# Altium project Driver_V1-1.PrjPcb
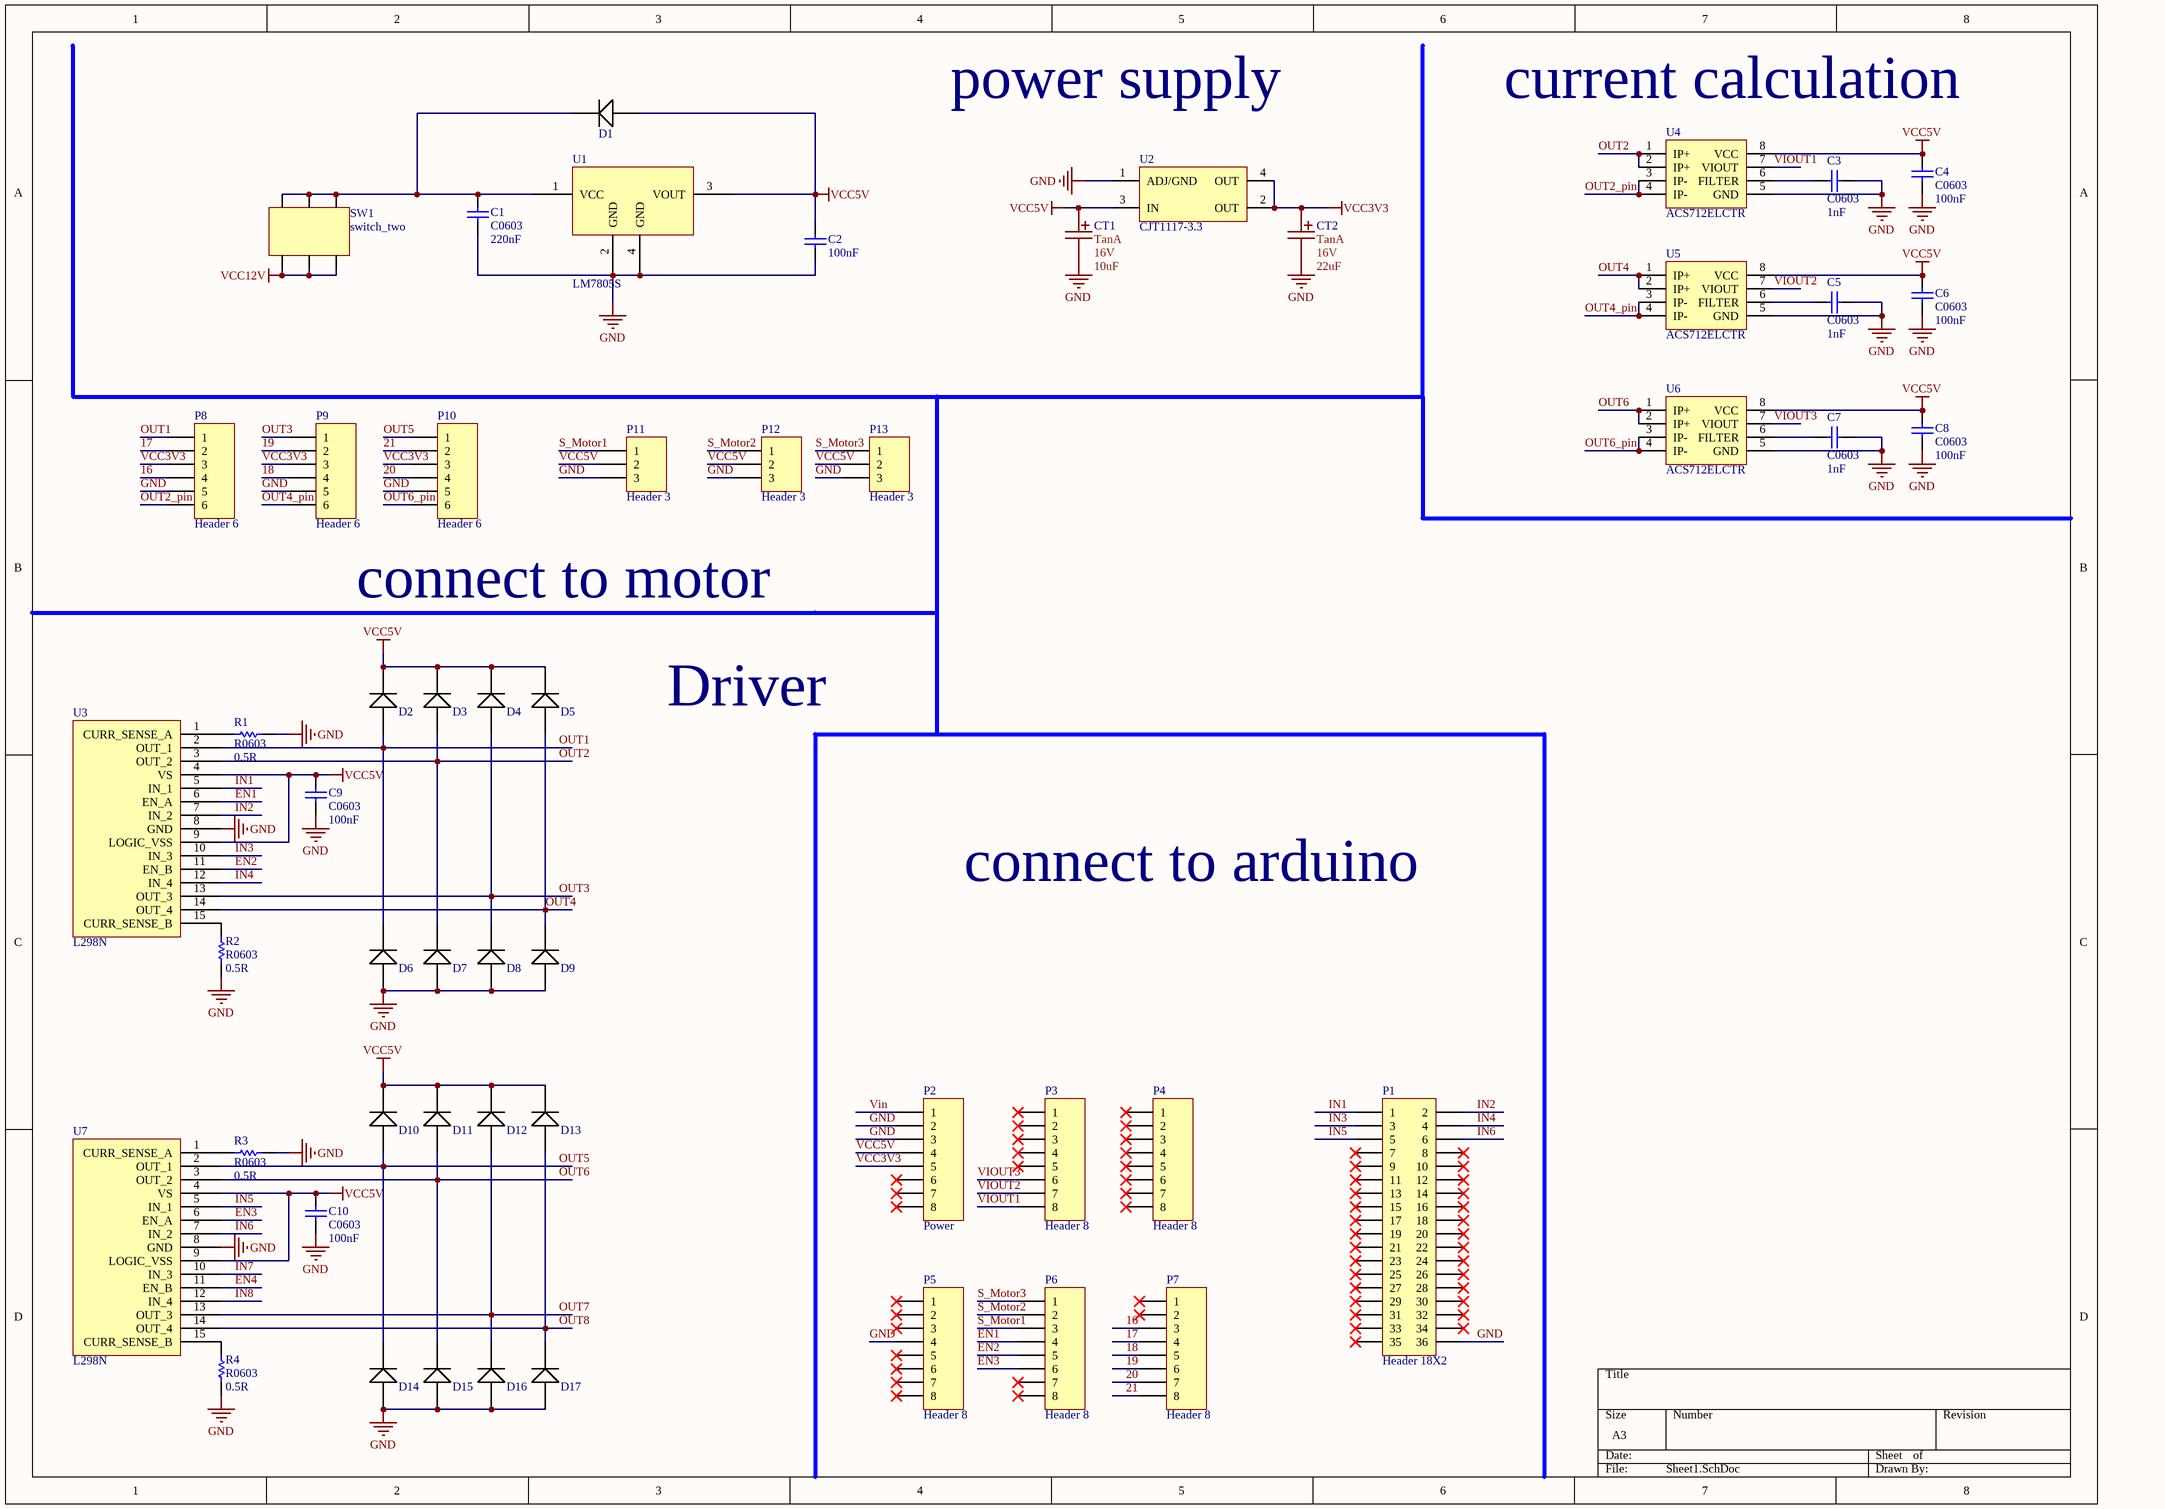
[diagram p0: Sheet1.SchDoc]
1 sheet, 54 parts. Net scope: global (net labels, ports and power ports of the same name join across sheets).
Board file: PCB1.PcbDoc

## Sheet Sheet1.SchDoc
size A3; SheetNumber: 1; SheetTotal: 1

### Parts
C1  Case/Package: C0603  [C0603_160X80X140L35N]  (hidden comment: 220nF)
C2  value 100nF  [C0402_100X50X140L30N]  (hidden comment: Capacitor)
C3  Case/Package: C0603  [C0603_160X80X140L35N]  (hidden comment: 1nF)
C4  Case/Package: C0603  [C0603_160X80X140L35N]  (hidden comment: 100nF)
C5  Case/Package: C0603  [C0603_160X80X140L35N]  (hidden comment: 1nF)
C6  Case/Package: C0603  [C0603_160X80X140L35N]  (hidden comment: 100nF)
C7  Case/Package: C0603  [C0603_160X80X140L35N]  (hidden comment: 1nF)
C8  Case/Package: C0603  [C0603_160X80X140L35N]  (hidden comment: 100nF)
C9  Case/Package: C0603  [C0603_160X80X140L35N]  (hidden comment: 100nF)
C10  Case/Package: C0603  [C0603_160X80X140L35N]  (hidden comment: 100nF)
CT1  Case/Package: TanA  Voltage: 16V  [CTA_320X160X180L85X120N]  (hidden comment: 10uF)
CT2  Case/Package: TanA  Voltage: 16V  [CTA_320X160X180L85X120N]  (hidden comment: 22uF)
D1  diode  [diode]  (value not drawn)
D2  diode  [diode]  (value not drawn)
D3  diode  [diode]  (value not drawn)
D4  diode  [diode]  (value not drawn)
D5  diode  [diode]  (value not drawn)
D6  diode  [diode]  (value not drawn)
D7  diode  [diode]  (value not drawn)
D8  diode  [diode]  (value not drawn)
D9  diode  [diode]  (value not drawn)
D10  diode  [diode]  (value not drawn)
D11  diode  [diode]  (value not drawn)
D12  diode  [diode]  (value not drawn)
D13  diode  [diode]  (value not drawn)
D14  diode  [diode]  (value not drawn)
D15  diode  [diode]  (value not drawn)
D16  diode  [diode]  (value not drawn)
D17  diode  [diode]  (value not drawn)
P1  Header 18X2  [HDR2X18]
P2  Power  [HDR1X8]
P3  Header 8  [HDR1X8]
P4  Header 8  [HDR1X8]
P5  Header 8  [HDR1X8]
P6  Header 8  [HDR1X8]
P7  Header 8  [HDR1X8]
P8  Header 6  [HDR1X6]
P9  Header 6  [HDR1X6]
P10  Header 6  [HDR1X6]
P11  Header 3  [HDR1X3]
P12  Header 3  [HDR1X3]
P13  Header 3  [HDR1X3]
R1  Case/Package: R0603  [R0603_160X80X140L35N]  (hidden comment: 0.5R)
R2  Case/Package: R0603  [R0603_160X80X140L35N]  (hidden comment: 0.5R)
R3  Case/Package: R0603  [R0603_160X80X140L35N]  (hidden comment: 0.5R)
R4  Case/Package: R0603  [R0603_160X80X140L35N]  (hidden comment: 0.5R)
SW1  switch_two  [switch_two]
U1  LM7805S  [LM7805S]
U2  CJT1117-3.3  [CJT1117]
U3  L298N  [PCBComponent_1]
U4  ACS712ELCTR  [ACS712ELCTR]
U5  ACS712ELCTR  [ACS712ELCTR]
U6  ACS712ELCTR  [ACS712ELCTR]
U7  L298N  [PCBComponent_1]

### Nets
GND: C1.1 C2.1 C3.1 C4.1 C5.1 C6.1 C7.1 C8.1 C9.1 C10.1 CT1.2(-) CT2.2(-) D6.1(-) D7.1(-) D8.1(-) D9.1(-) D14.1(-) D15.1(-) D16.1(-) D17.1(-) P1.36 P2.2 P2.3 P5.4 P8.5 P9.5 P10.5 P11.3 P12.3 P13.3 R1.1 R2.1 R3.1 R4.1 U1.2(GND) U1.4(GND) U2.1(ADJ/GND) U3.8(GND) U4.5(GND) U5.5(GND) U6.5(GND) U7.8(GND)
VCC3V3: CT2.1 P2.5 P8.3 P9.3 P10.3 U2.2(OUT) U2.4(OUT)
VCC5V: C2.2 C4.2 C6.2 C8.2 C9.2 C10.2 CT1.1 D1.1(-) D2.2(+) D3.2(+) D4.2(+) D5.2(+) D10.2(+) D11.2(+) D12.2(+) D13.2(+) P2.4 P11.2 P12.2 P13.2 U1.3(VOUT) U2.3(IN) U3.4(VS) U3.9(LOGIC_VSS) U4.8(VCC) U5.8(VCC) U6.8(VCC) U7.4(VS) U7.9(LOGIC_VSS)
VCC12V: SW1.4(A) SW1.5(A) SW1.6(A)
16: P7.3 P8.4
17: P7.4 P8.2
18: P7.5 P9.4
19: P7.6 P9.2
20: P7.7 P10.4
21: P7.8 P10.2
EN1: P6.4 U3.6(EN_A)
EN2: P6.5 U3.11(EN_B)
EN3: P6.6 U7.6(EN_A)
EN4: U7.11(EN_B)
IN1: P1.1 U3.5(IN_1)
IN2: P1.2 U3.7(IN_2)
IN3: P1.3 U3.10(IN_3)
IN4: P1.4 U3.12(IN_4)
IN5: P1.5 U7.5(IN_1)
IN6: P1.6 U7.7(IN_2)
IN7: U7.10(IN_3)
IN8: U7.12(IN_4)
OUT1: D2.1(-) D6.2(+) P8.1 U3.2(OUT_1)
OUT2: D3.1(-) D7.2(+) U3.3(OUT_2) U4.1(IP+) U4.2(IP+)
OUT2_pin: P8.6 U4.3(IP-) U4.4(IP-)
OUT3: D4.1(-) D8.2(+) P9.1 U3.13(OUT_3)
OUT4: D5.1(-) D9.2(+) U3.14(OUT_4) U5.1(IP+) U5.2(IP+)
OUT4_pin: P9.6 U5.3(IP-) U5.4(IP-)
OUT5: D10.1(-) D14.2(+) P10.1 U7.2(OUT_1)
OUT6: D11.1(-) D15.2(+) U6.1(IP+) U6.2(IP+) U7.3(OUT_2)
OUT6_pin: P10.6 U6.3(IP-) U6.4(IP-)
OUT7: D12.1(-) D16.2(+) U7.13(OUT_3)
OUT8: D13.1(-) D17.2(+) U7.14(OUT_4)
S_Motor1: P6.3 P11.1
S_Motor2: P6.2 P12.1
S_Motor3: P6.1 P13.1
Vin: P2.1
VIOUT1: P3.8 U4.7(VIOUT)
VIOUT2: P3.7 U5.7(VIOUT)
VIOUT3: P3.6 U6.7(VIOUT)
NetC1_2: C1.2 D1.2(+) SW1.1(A) SW1.2(A) SW1.3(A) U1.1(VCC)
NetC3_2: C3.2 U4.6(FILTER)
NetC5_2: C5.2 U5.6(FILTER)
NetC7_2: C7.2 U6.6(FILTER)
NetR1_2: R1.2 U3.1(CURR_SENSE_A)
NetR2_2: R2.2 U3.15(CURR_SENSE_B)
NetR3_2: R3.2 U7.1(CURR_SENSE_A)
NetR4_2: R4.2 U7.15(CURR_SENSE_B)

Not connected (* = marked no-connect by the designer): P1 7* 8* 9* 10* 11* 12* 13* 14* 15* 16* 17* 18* 19* 20* 21* 22* 23* 24* 25* 26* 27* 28* 29* 30* 31* 32* 33* 34* 35*; P2 6* 7* 8*; P3 1* 2* 3* 4* 5*; P4 1* 2* 3* 4* 5* 6* 7* 8*; P5 1* 2* 3* 5* 6* 7* 8*; P6 7* 8*; P7 1* 2*

### Notes on the sheet
- power supply
- current calculation
- connect to motor
- Driver
- connect to arduino

### Library data of the parts
C1 C3-C10 = Cap0603: 0603 SMT MLCC Capacitor; Voltage: 50V; Tolerance: 10%; ProductIndex: 11; Published: 8-Jun-2000; LatestRevisionDate: 17-Jul-2002; LatestRevisionNote: Re-released for DXP Platform.; PackageReference: RAD-0.3; Publisher: Altium Limited; PackageDescription: Radial Cap, Thru-Hole; 2 Leads; 0.3 in Pin Spacing; Voltage Rating: 50V; ProductType: Capacitors
  C1: Value: 220nF
  C3 C5 C7: Value: 1nF
  C4 C6 C8-C10: Value: 100nF
C2 = Cap1: SMT MLCC Capacitor; Published: 8-Jun-2000; LatestRevisionDate: 17-Jul-2002; LatestRevisionNote: Re-released for DXP Platform.; PackageReference: RAD-0.3; Publisher: Altium Limited; PackageDescription: Radial Cap, Thru-Hole; 2 Leads; 0.3 in Pin Spacing
CT1 CT2 = Cap_TanA: A case Tantalum Capacitors; Tolerance: 10%; ProductIndex: 11; Case Code (Imperial): 1206; Case Code (Metric): 3216; ProductType: Capacitors
  CT1: Value: 10uF
  CT2: Value: 22uF
P1 = Header 18X2: Header, 18-Pin, Dual row; LatestRevisionDate: 17-Jul-2002; LatestRevisionNote: Re-released for DXP Platform.; Publisher: Altium Limited
P2-P7 = Header 8: Header, 8-Pin; LatestRevisionDate: 17-Jul-2002; LatestRevisionNote: Re-released for DXP Platform.; Publisher: Altium Limited
P8-P10 = Header 6: Header, 6-Pin; LatestRevisionDate: 17-Jul-2002; LatestRevisionNote: Re-released for DXP Platform.; Publisher: Altium Limited
P11-P13 = Header 3: Header, 3-Pin; LatestRevisionDate: 17-Jul-2002; LatestRevisionNote: Re-released for DXP Platform.; Publisher: Altium Limited
R1-R4 = Res0603: 0603 SMT Resistor; Tolerance: 1%; ProductIndex: 10; Published: 8-Jun-2000; LatestRevisionDate: 17-Jul-2002; LatestRevisionNote: Re-released for DXP Platform.; PackageReference: AXIAL-0.3; Publisher: Altium Limited; PackageDescription: Axial Device, Thru-Hole; 2 Leads; 0.3 in Pin Spacing; ProductType: Resistors; Value: 0.5R